# Altium project buck_bridge_amplifier.PrjPcb
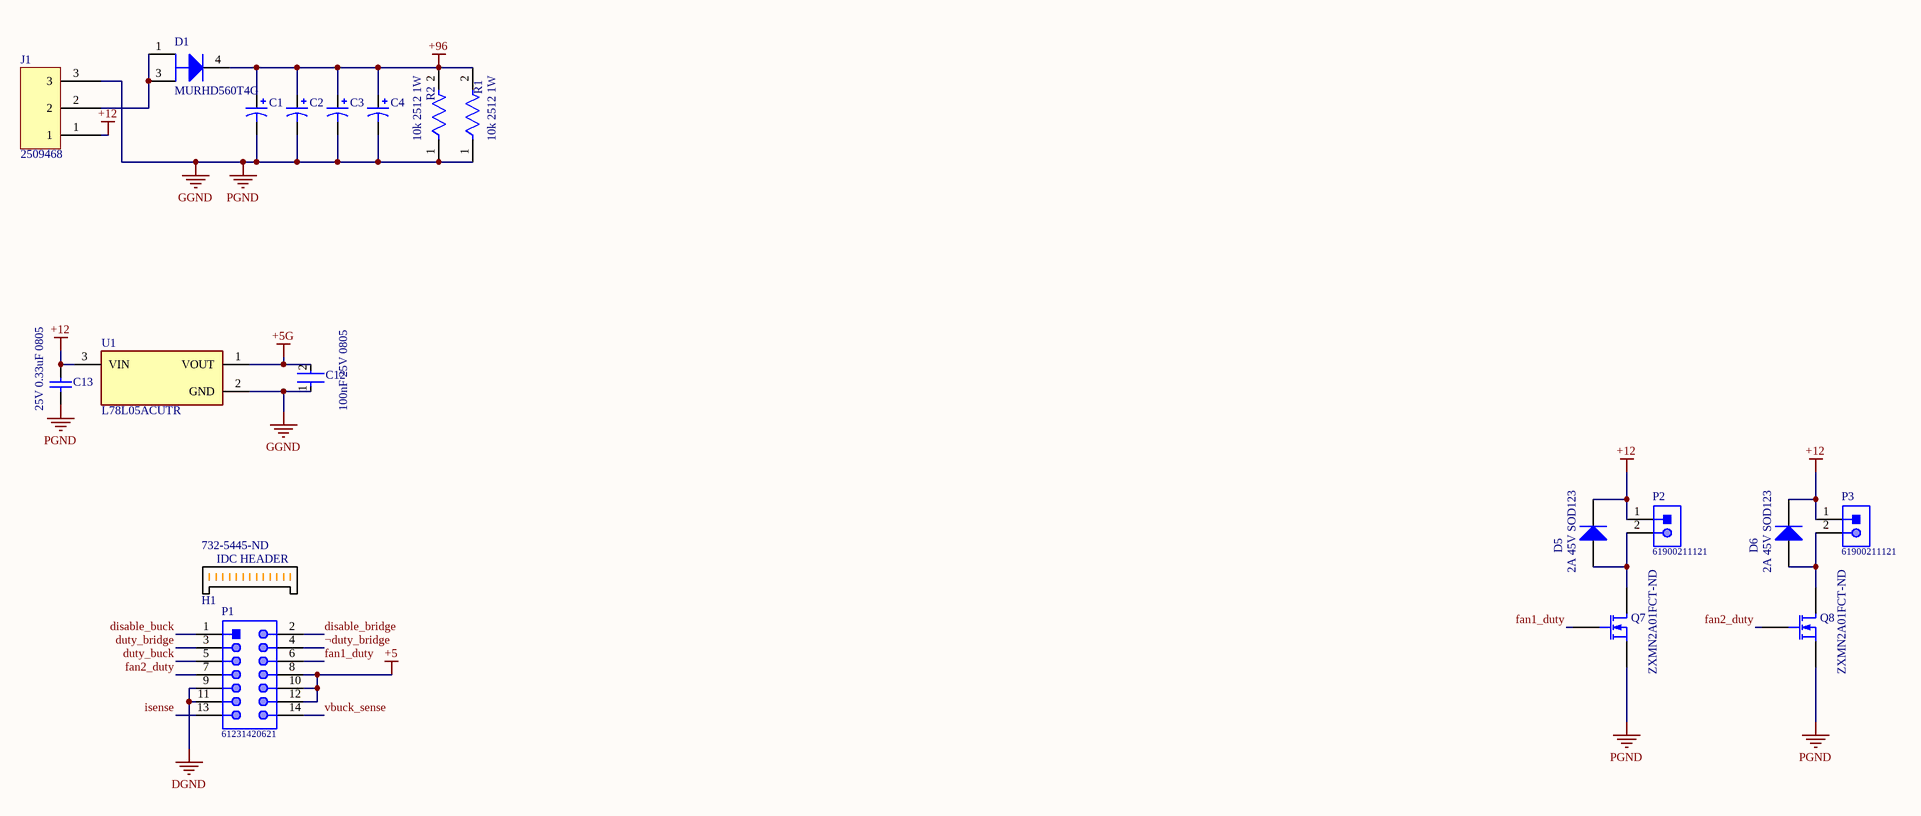
[diagram p0: input_power.SchDoc]
2 sheets, 34 parts. Net scope: hierarchical (ports join the sheet entries above them; power ports are global).
Board file: buck_bridge_amplifier.PcbDoc
Sheets:
  input_power.SchDoc
  buck.SchDoc

## Sheet input_power.SchDoc
size A3; SheetNumber: 2; SheetTotal: 6

### Parts
C1  560uF 80V  [80ZLH560MEFC18X20]  (value not drawn)
C2  560uF 80V  [80ZLH560MEFC18X20]  (value not drawn)
C3  560uF 80V  [80ZLH560MEFC18X20]  (value not drawn)
C4  560uF 80V  [80ZLH560MEFC18X20]  (value not drawn)
C12  100nF 25V 0805  [FP-CC0805-0_85-MFG]
C13  25V 0.33uF 0805  [CAPC2013X140X50ML20T25]
D1  MURHD560T4G  [ONSC-DPAK-3-369C-01_V]
D5  2A 45V SOD123  [SOD123F]
D6  2A 45V SOD123  [SOD123F]
H1  Supplier Part Number 1: 732-5445-ND  (hidden comment: Generic IDC Header)
J1  Supplier Part Number 1: 2509468  [weidmuller_3p_20A]  (hidden comment: weidmuller_20A_3p)
P1  61231420621  [61231420621]
P2  61900211121  [61900211121]
P3  61900211121  [61900211121]
Q7  Supplier Part Number 1: ZXMN2A01FCT-ND  [DIODES SOT-23-3]  (hidden comment: MOSFET-N)
Q8  Supplier Part Number 1: ZXMN2A01FCT-ND  [DIODES SOT-23-3]  (hidden comment: MOSFET-N)
R1  10k 2512 1W  [FP-CRCW2512-e3-IPC_C]
R2  10k 2512 1W  [FP-CRCW2512-e3-IPC_C]
U1  L78L05ACUTR  [FP-SOT-89-7098166-MFG]

### Nets
+5: P1.8 P1.10 P1.12
+5G: C12.2 U1.1(VOUT)
+12: C13.2 D5.2(K) D6.2(K) J1.1 P2.1 P3.1 U1.3(VIN)
+96: C1.1 C2.1 C3.1 C4.1 D1.4(K) R1.2 R2.2
DGND: P1.9 P1.11
GGND: C1.2 C2.2 C3.2 C4.2 C12.1 C13.1 J1.3 Q7.3(S) Q8.3(S) R1.1 R2.1 U1.2(GND)  [also labelled PGND]
disable_bridge: P1.2
disable_buck: P1.1
duty_bridge: P1.3
duty_buck: P1.5
fan1_duty: P1.6 Q7.2(G)
fan2_duty: P1.7 Q8.2(G)
isense: P1.13
vbuck_sense: P1.14
¬duty_bridge: P1.4
NetD1_1: D1.1(A) D1.3(A) J1.2
NetD5_1: D5.1(A) P2.2 Q7.1(D)
NetD6_1: D6.1(A) P3.2 Q8.1(D)

### Notes on the sheet
- 1
- 2
- 3
- 4
- 5
- 6
- 7
- 8
- A
- B
- C
- D
- Project:
- Date:
- Drawing number:
- Rev:
- Format:
- A3
- Drawn by:
- Laboratory:
- Page
- Sheet:
- of
- File:
- (in symbol generic_idc_header) IDC HEADER

### Library data of the parts
C1-C4 = Cap Pol1: Polarized Capacitor (Radial); Published: 8-Jun-2000; LatestRevisionDate: 17-Jul-2002; LatestRevisionNote: Re-released for DXP Platform.; PackageReference: RB7.6-15; Publisher: Altium Limited; PackageDescription: Polarized Capacitor (Radial); 2 Leads; Value: 560uF; Supplier 1: Digi-Key; Supplier Part Number 1: 1189-3057-ND
C12 = CMP-1036-04410-2: CAP CER 0.1UF 25V X7R 0805; Manufacturer Part Number: CC0805KRX7R8BB104; Manufacturer: Yageo; Tolerance: 0.1; Material: Ceramic; ComponentLink2URL: http://www.yageo.com/documents/recent/UPY-GPHC_Y5V_6.3V-to-50V_8.pdf; Category: Cap; Mouser Description: Multilayer Ceramic Capacitors MLCC - SMD/SMT 100nF 25V X7R 10%; Device Class L1: Passive Components; Footprint Url: http://www.yageo.com/exep/pages/download/literatures/UPY-C_GEN_24.pdf; Height: 0.95mm; Digikey Description: CAP CER 0.1UF 25V X7R 0805; Lead Free: Yes; Temperature Range High: +85°C; Temperature: -30°C to +85°C; Ipc Land Pattern Name: CAPC200125X85; Value: 100 nF; Capacitance: 100 nF; Automotive: No; Octopart: https://octopart.com/cc0805krx7r8bb104-yageo-39467766; Device Class L2: Capacitors; Temperature Characteristic: X7R; Voltage Rating: 25 V; ComponentLink2Description: Datasheet; Temperature Range Low: -30°C; Device Class L3: Ceramic Capacitors; RoHS: TRUE; Package: CC0805-0.85
C13 = CMP-2007-04608-1: Part Number: 08053C334KAT2A; Manufacturer: AVX Interconnect / Elco
D1 = CMP-0902-00243-1: Power Rectifier, 3-Pin DPAK, Pb-Free, Tape and Reel; Manufacturer: On Semiconductor; Type: Ultrafast; VRRM Max (V): 600; IFSM Max (A): 50; Mounting Technology: Surface Mount; RoHS: TRUE; PartNumber: MURHD560T4G; PackageVersion: Rev. E, 02/2014; ComponentLink3URL: http://www.onsemi.cn/pub_link/Collateral/369C.PDF; ComponentLink1Description: Manufacturer URL; PackageDescription: 3-Pin Flange Mount, Body 6.54 x 6.095 mm, Pitch 2.29 mm; ComponentLink3Description: Package Specification; ComponentLink1URL: http://www.onsemi.com/; Packing: Tape and Reel; ComponentLink2URL: http://www.onsemi.cn/pub_link/Collateral/MURHD560-D.PDF; ComponentLink2Description: Datasheet; PackageReference: DPAK-3-369C-01; DatasheetVersion: Rev. 8
D5 D6 = Diode: Default Diode; Published: 8-Jun-2000; LatestRevisionDate: 17-Jul-2002; LatestRevisionNote: Re-released for DXP Platform.; PackageVersion: Sep-1996; PackageReference: SMC; Publisher: Altium Limited; PackageDescription: DO-214-AB/SMC; 2 C-Bend Leads; Body 7.9 x 5.9 mm, inc. leads (LxW); Code_JEDEC: DO-214-AB; Supplier 1: RSComponents; Supplier Part Number 1: 8673249P
H1 = generic_idc_header: Assign Supplier Link Manually; Supplier 1: Digi-Key
J1 = weidmuller_20A_3p: 3 Pin Terminal Block 19A Male Receptor; Supplier 1: Farnell
P1 = CMP-1502-00061-1: Male Box Header WR-BHD, SMT, Vertical, pitch 2.54 mm, 14 pins; Manufacturer: Wurth Elektronik; Pitch: 2.54mm; Working Voltage: 250VAC; Contact Resistance: 20mOhm; Pin Number: 14; Withstanding Voltage: 500VAC; System: Connector; Manufacturer URL: http://www.we-online.de; Published Date: August2018; Packaging: TapeandReel; Operating Temperature: -40to125degC; Publisher: WurthElektronik; Orientation: Vertical; Mounting Technology: SMT; Gender: Male; Package Reference: 61231420621; Part Number: 61231420621; Datasheet URL: https://katalog.we-online.de/em/datasheet/6123xx20621.pdf
P2 P3 = CMP-1502-00584-1: Male Locking Header WR-WTB, THT, Vertical, pitch 2.54 mm, 1 x 2 position; Manufacturer: Wurth Elektronik; Position: 1x2; Contact Resistance: 20mOhm; Working Voltage: 250VAC; Pitch: 2.54mm; Gender: Male; Part Number: 61900211121; Mounting Technology: THT; Operating Temperature: -40to105degC; Orientation: Vertical; Packaging: Bag; Package Reference: 61900211121; Manufacturer URL: http://www.we-online.de; Datasheet URL: https://katalog.we-online.de/em/datasheet/6190xx11121.pdf; Publisher: WurthElektronik
Q7 Q8 = MOSFET-N: 20V 120mOhm Vgs=700mV; Published: 8-Jun-2000; LatestRevisionDate: 17-Jul-2002; LatestRevisionNote: Re-released for DXP Platform.; PackageVersion: 1995/1996; PackageReference: E3; Publisher: Altium Limited; PackageDescription: TO, Flat Index; 3 In-Line, Axial Leads; Body Dia. 4.6mm; Lead Dia. 0.5 mm (max); Supplier 1: Digi-Key
R1 R2 = CMP-02407-002758-1: RES Thick Film, 10kΩ, 5%, 1W, 200ppm/°C, 2512 / CRCW251210K0JNEG; Resistance: 10kR; Voltage Rating: 500V; Termination: SMD/SMT; Weight: 0.001429oz; Number of Terminations: 2; Package Quantity: 1; Case/Package: 2512; Length: 6.3mm; Temperature Coefficient: 200ppm/°C; Packaging: Tape and Reel; Voltage Rating (DC): 500V; Case Code (Imperial): 2512; Max Operating Temperature: 155°C; Number of Pins: 2; Height: 0.028inch; Military Standard: Not; Lead Free: Lead Free; Min Operating Temperature: -55°C; Features: Automotive AEC-Q200; Contact Plating: Tin; Depth: 3.15mm; Mount: Surface Mount; REACH SVHC: No SVHC; Composition: Thick Film; Radiation Hardening: No; Max Power Dissipation: 1W; Case Code (Metric): 6432; Power Rating: 1W; Width: 0.124inch; Tolerance: 5%
U1 = CMP-0244-00407-2: IC REG LINEAR 5V 100MA SOT89-3; Output Voltage Accuracy: 4%; Number of Regulators: 1; Polarity: Positive; Quiescent Current: 6mA; Min Input Voltage: 7V; Power Supply Rejection Ratio (PSRR): 49dB; Output Type: Fixed; Max Input Voltage: 30V; Dropout Voltage: 1.7V; Nominal Output Voltage: 5V; Radiation Hardening: No; Number of Pins: 3; Weight: 0.004603oz; Output Current: 100mA; Width: 2.6mm; Packaging: Tape and Reel; Output Voltage: 5V; Length: 4.6mm; Max Output Current: 100mA; Min Operating Temperature: 0°C; Package Quantity: 1; Accuracy: 4%; Case/Package: SOT-89; Lead Free: Lead Free; Height: 1.6mm; Min Output Voltage: 5V; Contact Plating: Tin; Number of Outputs: 1; REACH SVHC: No SVHC; Mount: Surface Mount; Max Operating Temperature: 125°C

## Sheet buck.SchDoc
size A3; SheetNumber: 6; SheetTotal: 6
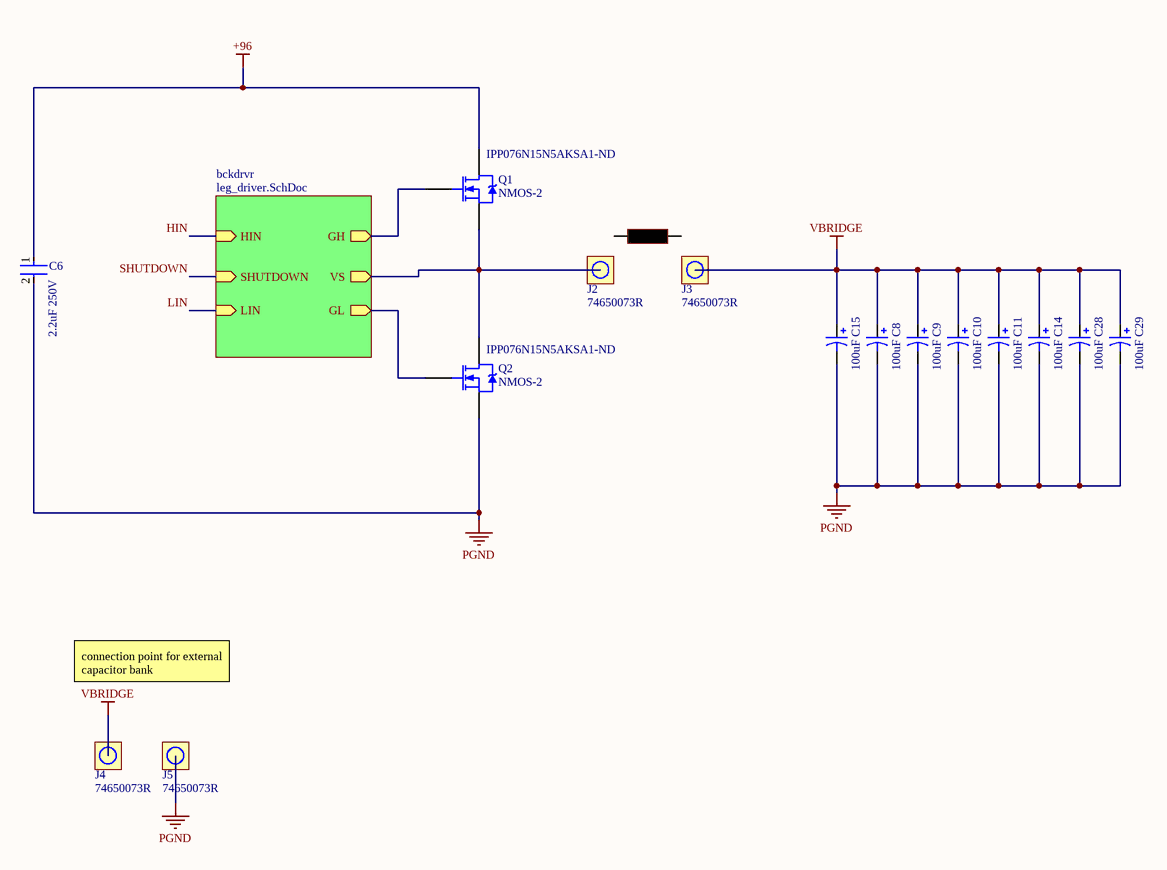
[diagram p1: buck.SchDoc]

### Parts
C6  2.2uF 250V  [FP-CGA9P-IPC_B]
C8  100uF  [electrolyte_10mm_5mm]
C9  100uF  [electrolyte_10mm_5mm]
C10  100uF  [electrolyte_10mm_5mm]
C11  100uF  [electrolyte_10mm_5mm]
C14  100uF  [electrolyte_10mm_5mm]
C15  100uF  [electrolyte_10mm_5mm]
C28  100uF  [electrolyte_10mm_5mm]
C29  100uF  [electrolyte_10mm_5mm]
J2  74650073R  [screw_terminal]
J3  74650073R  [screw_terminal]
J4  74650073R  [screw_terminal]
J5  74650073R  [screw_terminal]
Q1  NMOS-2  Supplier Part Number 1: IPP076N15N5AKSA1-ND  [TO-220AB]
Q2  NMOS-2  Supplier Part Number 1: IPP076N15N5AKSA1-ND  [TO-220AB]

### Sub-sheets
bckdrvr = leg_driver.SchDoc (file not in this document): GH (out), HIN (in), LIN (in), SHUTDOWN (in), GL (out), VS (out)

### Nets
+96: C6.1 Q1.2(D)
PGND: C6.2 C8.2 C9.2 C10.2 C11.2 C14.2 C15.2 C28.2 C29.2 J5.1 Q2.3(S)  [project net GGND]
VBRIDGE: C8.1 C9.1 C10.1 C11.1 C14.1 C15.1 C28.1 C29.1 J3.1 J4.1
HIN: sheet bckdrvr/HIN
LIN: sheet bckdrvr/LIN
SHUTDOWN: sheet bckdrvr/SHUTDOWN
NetJ2_1: J2.1 Q1.3(S) Q2.2(D) ; sheet bckdrvr/VS
NetQ1_1: Q1.1(G) ; sheet bckdrvr/GH
NetQ2_1: Q2.1(G) ; sheet bckdrvr/GL

### Notes on the sheet
- connection point for external capacitor bank
- 1
- 2
- 3
- 4
- 5
- 6
- 7
- 8
- A
- B
- C
- D
- Project:
- Date:
- Drawing number:
- Rev:
- Format:
- A3
- Drawn by:
- Laboratory:
- Page
- Sheet:
- of
- File:

### Library data of the parts
C6 = CMP-08246-001668-1: Cap Ceramic 2.2uF 250V X7T 20% Pad SMD 2220 +125°C Automotive T/R / CGA9P3X7T2E225M250KE; Weight: 0.016932oz; Width: 0.197inch; Depth: 5mm; Termination: SMD/SMT; Capacitance: 2.2uF; Voltage Rating (DC): 250V; Dielectric: X7T; Case/Package: 2220; Package Quantity: 500; Height: 2.5mm; Min Operating Temperature: -55°C; Case Code (Metric): 5750; Features: Soft Termination; Max Operating Temperature: 125°C; Ratings: AEC-Q200; Thickness: 0.098inch; Length: 5.7mm; Mount: Surface Mount; Tolerance: 20%; Voltage Rating: 250V; Case Code (Imperial): 2220; Packaging: Tape and Reel
C8-C11 C14 C15 C28 C29 = Cap Pol1: Polarized Capacitor (Radial); Published: 8-Jun-2000; LatestRevisionDate: 17-Jul-2002; LatestRevisionNote: Re-released for DXP Platform.; PackageReference: RB7.6-15; Publisher: Altium Limited; PackageDescription: Polarized Capacitor (Radial); 2 Leads
J2-J5 = screw_socket: 74650073R 50A; Supplier 1: Digi-Key; Supplier Part Number 1: 732-10882-1-ND
Q1 Q2 = NMOS-2: N-Channel Power MOSFET; Note: Pin 2 is electrically connected to pin 4.; Published: 8-Jun-2000; LatestRevisionDate: 17-Jul-2002; LatestRevisionNote: Re-released for DXP Platform.; DatasheetVersion: PD-9.814; PackageVersion: Feb-1997; PackageReference: TO-220AB; Publisher: Altium Limited; PackageDescription: TO, Thru-Hole, Vertical, Heatsink Mounted; 3 In-Line Leads; Pitch 2.54 mm; ComponentLink1Description: Manufacturer Link; ComponentLink1URL: http://www.irf.com/; Supplier 1: Digi-Key

## Nets that join several sheets
+96: input_power (7 pins), buck (C6.1 Q1.2)
GGND: input_power (12 pins), buck (11 pins)